# EAGLE design grbl2prll (EAGLE 8.1.0)
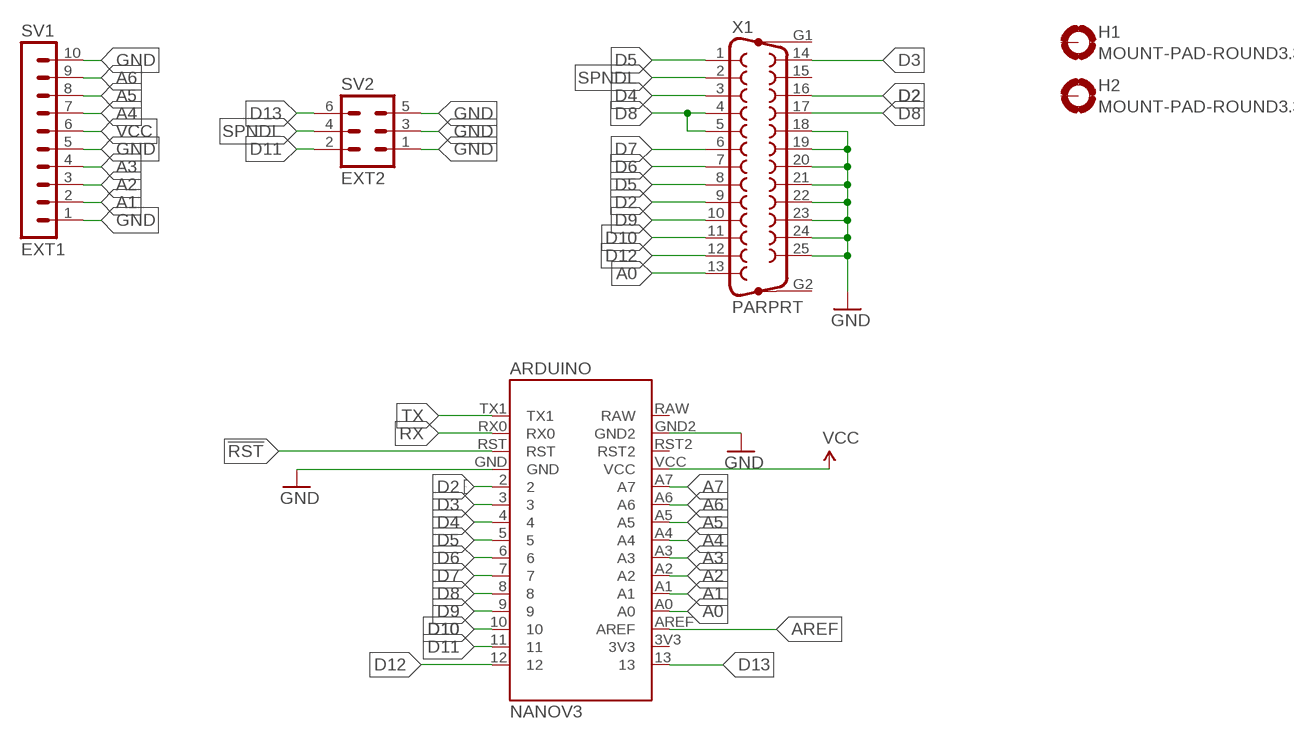
[diagram p0: schematic, sheet 1]

## Parts
ARDUINO  NANOV3  [NANOV3]
H1  MOUNT-PAD-ROUND3.3  [3,3-PAD]
H2  MOUNT-PAD-ROUND3.3  [3,3-PAD]
SV1  EXT1  MA10-1  [MA10-1]
SV2  EXT2  MA03-2  [MA03-2]
X1  PARPRT  F25HP  [F25HP]

## Nets
!RST: ARDUINO.RST
A0: ARDUINO.A0 X1.13
A1: ARDUINO.A1 SV1.2
A2: ARDUINO.A2 SV1.3
A3: ARDUINO.A3 SV1.4
A4: ARDUINO.A4 SV1.7
A5: ARDUINO.A5 SV1.8
A6: ARDUINO.A6 SV1.9
A7: ARDUINO.A7
AREF: ARDUINO.AREF
D2: ARDUINO.2 X1.9 X1.16
D3: ARDUINO.3 X1.14
D4: ARDUINO.4 X1.3
D5: ARDUINO.5 X1.1 X1.8
D6: ARDUINO.6 X1.7
D7: ARDUINO.7 X1.6
D8: ARDUINO.8 X1.4 X1.5 X1.17
D9: ARDUINO.9 X1.10
D10: ARDUINO.10 X1.11
D11: ARDUINO.11 SV2.2
D12: ARDUINO.12 X1.12
D13: ARDUINO.13 SV2.6
GND [GND]: ARDUINO.GND ARDUINO.GND2 SV1.1 SV1.5 SV1.10 SV2.1 SV2.3 SV2.5 X1.18 X1.19 X1.20 X1.21 X1.22 X1.23 X1.24 X1.25
RX: ARDUINO.RX0
SPNDL: SV2.4 X1.2
TX: ARDUINO.TX1
VCC [VCC]: ARDUINO.VCC SV1.6
Unconnected: ARDUINO.3V3 ARDUINO.RAW ARDUINO.RST2 H1.B3,3(MOUNT) H2.B3,3(MOUNT) X1.15 X1.G1 X1.G2

## Library data of the parts
ARDUINO = Arduino Nano by Jazz:NANOV3
H1 H2 = holes:MOUNT-PAD-ROUND: MOUNTING PAD, round
SV1 = con-lstb:MA10-1: PIN HEADER; OC_FARNELL: unknown; OC_NEWARK: unknown
SV2 = con-lstb:MA03-2: PIN HEADER; OC_FARNELL: unknown; OC_NEWARK: unknown
X1 = con-subd:F25HP: SUB-D; OC_FARNELL: unknown; OC_NEWARK: unknown

## Net classes
0 default: width 0.762 mm, clearance 0.406 mm
1 GND: width 1.27 mm, clearance 0.406 mm
2 VCC: width 1.27 mm, clearance 0.406 mm

## Board
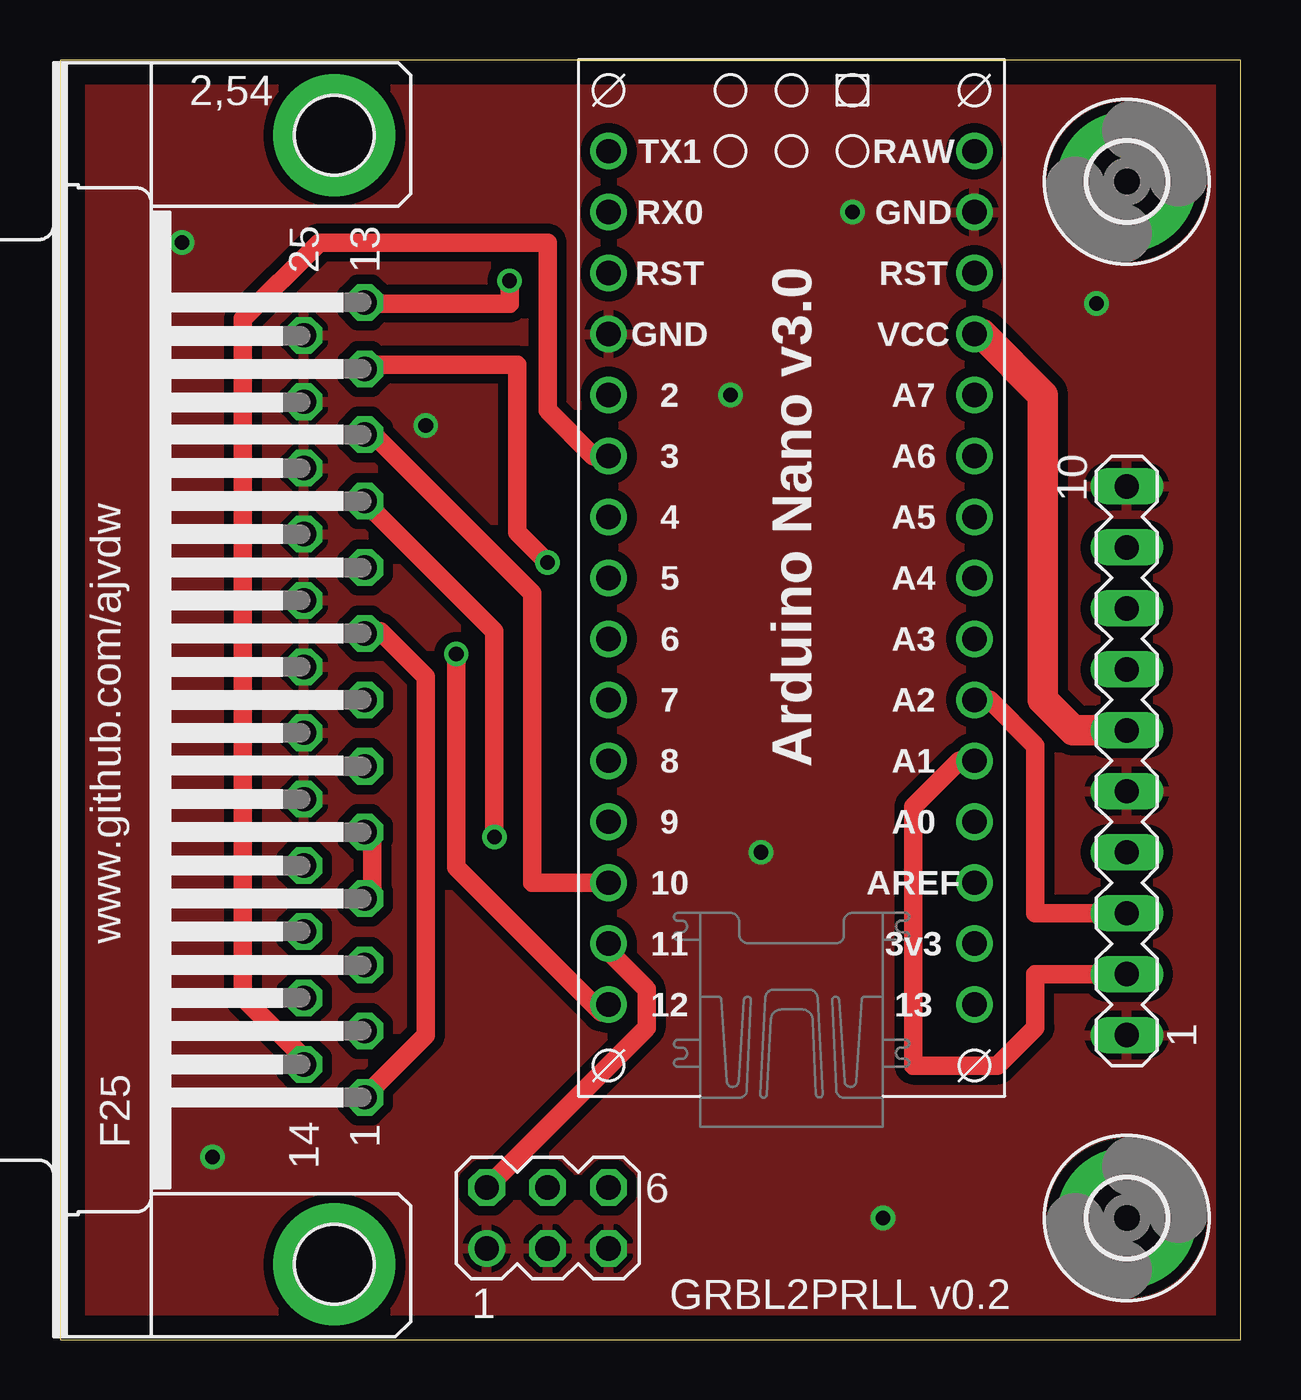
[diagram p1: board, top side]
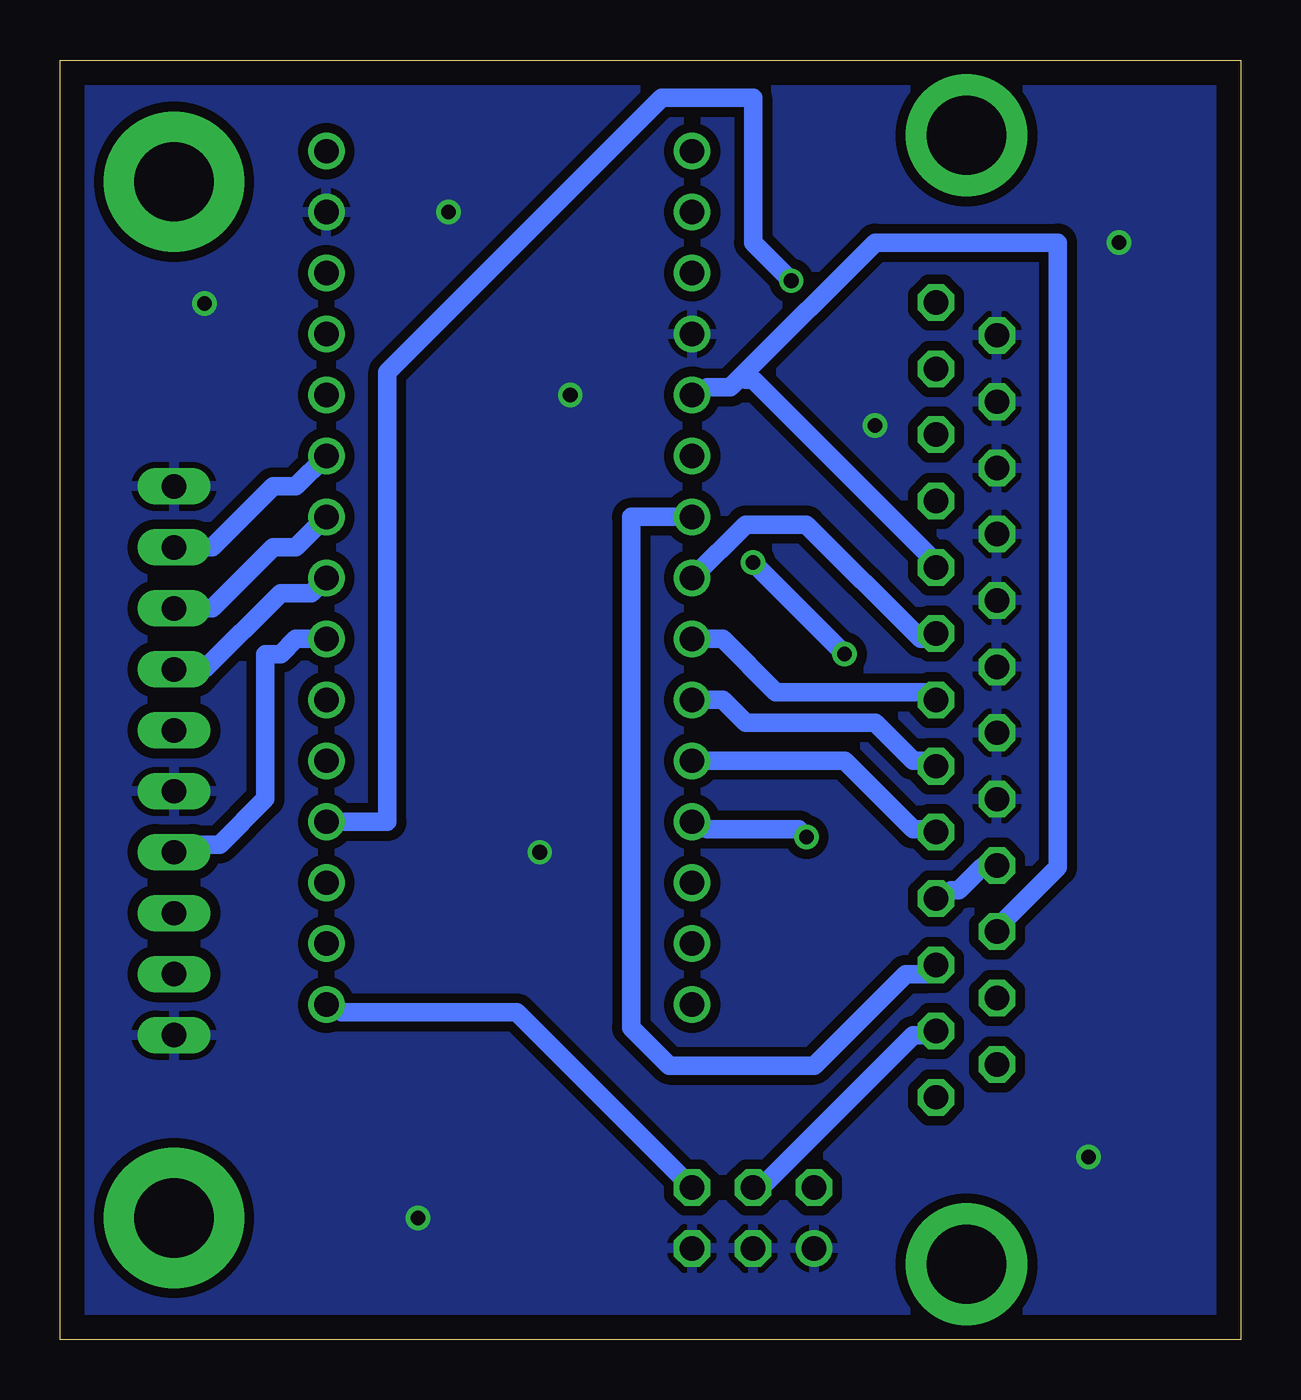
[diagram p2: board, bottom side, seen from below]

Size 49.2 x 53.33 mm. Coordinates in mm from the lower left corner, seen from the top.
Outline: 0,0 49.2,0 49.2,53.33 0,53.33 0,0
Copper layers (1*16): Top 0.035mm / dielectric 1.5mm / Bottom 0.035mm
Design rules "default": minimum track width 10mil, minimum drill 24mil, track to track 8mil, track to pad 8mil, pad to pad 8mil, via to via 8mil, smd to smd 8mil, copper to edge 40mil, drill to drill 8mil, minimum pad ring 10mil, minimum via ring 8mil, stop-mask expansion 4mil, vias tented up to drill 0mil, thermal gap 10mil

### Footprints (pad centres in the part's own frame; a part is rotated, then mirrored left to right if it is on the bottom)
NANOV3 = drill 1.016: 2 -7.62,5.08; 3 -7.62,2.54; 3V3 7.62,-17.78; 4 -7.62,0; 5 -7.62,-2.54; 6 -7.62,-5.08; 7 -7.62,-7.62; 8 -7.62,-10.16; 9 -7.62,-12.7; 10 -7.62,-15.24; 11 -7.62,-17.78; 12 -7.62,-20.32; 13 7.62,-20.32; A0 7.62,-12.7; A1 7.62,-10.16; A2 7.62,-7.62; A3 7.62,-5.08; A4 7.62,-2.54; A5 7.62,0; A6 7.62,2.54; A7 7.62,5.08; AREF 7.62,-15.24; GND -7.62,7.62; GND2 7.62,12.7; RAW 7.62,15.24; RST -7.62,10.16; RST2 7.62,10.16; RX0 -7.62,12.7; TX1 -7.62,15.24; VCC 7.62,7.62
3,3-PAD = drill 3.3 pad 5.842: B3,3 0,0
MA10-1 = drill 1.016 long: 1 -11.43,0; 2 -8.89,0; 3 -6.35,0; 4 -3.81,0; 5 -1.27,0; 6 1.27,0; 7 3.81,0; 8 6.35,0; 9 8.89,0; 10 11.43,0
MA03-2 = drill 1.016: 1 -2.54,-1.27 | drill 1.016 octagon: 2 -2.54,1.27; 3 0,-1.27; 4 0,1.27; 5 2.54,-1.27; 6 2.54,1.27
F25HP = drill 1.016 octagon: 1 -16.561,-1.27; 2 -13.792,-1.27; 3 -11.049,-1.27; 4 -8.28,-1.27; 5 -5.512,-1.27; 6 -2.769,-1.27; 7 0,-1.27; 8 2.769,-1.27; 9 5.512,-1.27; 10 8.28,-1.27; 11 11.049,-1.27; 12 13.792,-1.27; 13 16.561,-1.27; 14 -15.189,1.27; 15 -12.421,1.27; 16 -9.652,1.27; 17 -6.909,1.27; 18 -4.14,1.27; 19 -1.372,1.27; 20 1.372,1.27; 21 4.14,1.27; 22 6.909,1.27; 23 9.652,1.27; 24 12.421,1.27; 25 15.189,1.27 | drill 3.302 pad 5.08: G1 -23.52,0; G2 23.52,0

### Placement (x,y rotation side)
ARDUINO  30.48,34.29 0 top
H1  44.45,5.08 0 top
H2  44.45,48.26 0 top
SV1  44.45,24.13 90 top
SV2  20.32,5.08 0 top
X1  11.43,26.67 90 top

### Tracks (layer width: path | path; a pad name or v marks a point on that pad's centre or on a via)
A0  (via drill 0.61)
  Top 0.762: v18.73,44.13 18.73,43.18 12.7,43.18 X1.13
  Bottom 0.762: v18.73,44.13 20.32,45.72 20.32,51.75 24.13,51.75 35.56,40.32 35.56,21.59 ARDUINO.A0
A1
  Top 0.762: SV1.2 40.64,15.24 40.64,13.02 39.05,11.43 35.56,11.43 35.56,22.23 37.47,24.13 ARDUINO.A1
A2
  Top 0.762: SV1.3 40.64,17.78 40.64,24.77 38.73,26.67 ARDUINO.A2
A3
  Bottom 0.762: SV1.4 44.13,20.64 42.55,20.64 40.64,22.54 40.64,28.57 40.01,28.57 39.37,29.21 ARDUINO.A3
A4
  Bottom 0.762: ARDUINO.A4 38.73,31.11 40.01,31.11 43.18,27.94 SV1.7
A5
  Bottom 0.762: ARDUINO.A5 39.37,33.02 40.32,33.02 42.86,30.48 SV1.8
A6
  Bottom 0.762: ARDUINO.A6 39.37,35.56 40.32,35.56 42.86,33.02 SV1.9
D2
  Bottom 0.762: 20.8,40.16 21.27,39.69 22.23,39.69 22.54,39.37 ARDUINO.2 | 20.8,40.16 15.24,45.72 7.62,45.72 7.62,19.68 10.16,17.14 X1.16 | X1.9 12.7,32.38 20.32,40.01 20.64,40.01 20.8,40.16
D3
  Top 0.762: ARDUINO.3 22.23,36.83 20.32,38.73 20.32,45.72 10.79,45.72 7.62,42.55 7.62,14.29 10.16,11.75 X1.14
D4
  Bottom 0.762: ARDUINO.4 25.4,34.29 25.4,13.02 23.81,11.43 17.78,11.43 13.97,15.24 13.02,15.24 12.7,15.56 X1.3
D5
  Top 0.762: X1.1 12.7,10.16 15.24,12.7 15.24,27.62 13.34,29.53 12.7,29.53 X1.8
  Bottom 0.762: ARDUINO.5 20.64,33.97 18.1,33.97 13.34,29.21 12.7,29.21 X1.8
D6
  Bottom 0.762: X1.7 13.02,26.99 19.37,26.99 21.59,29.21 ARDUINO.6
D7
  Bottom 0.762: ARDUINO.7 21.59,26.67 20.64,25.72 15.24,25.72 13.65,24.13 12.7,24.13 X1.6
D8
  Top 0.762: X1.4 12.7,18.41 13.02,18.73 13.02,20.95 12.7,21.27 X1.5
  Bottom 0.762: X1.17 10.16,19.68 10.79,19.68 11.75,18.73 12.06,18.73 12.38,18.41 12.7,18.41 X1.4 | ARDUINO.8 16.51,24.13 13.65,21.27 12.7,21.27 X1.5
D9  (via drill 0.61)
  Top 0.762: v18.1,20.95 18.1,29.53 12.7,34.92 X1.10
  Bottom 0.762: v18.1,20.95 18.41,21.27 22.23,21.27 22.54,21.59 ARDUINO.9
D10
  Top 0.762: ARDUINO.10 19.68,19.05 19.68,31.11 13.02,37.78 12.7,37.78 X1.11
D11
  Top 0.762: SV2.2 24.45,13.02 24.45,14.61 22.86,16.19 ARDUINO.11
D12  (via drill 0.61)
  Top 0.762: v20.32,32.38 19.05,33.66 19.05,40.64 12.7,40.64 X1.12 | v16.51,28.57 16.51,19.68 22.54,13.65 22.86,13.65 ARDUINO.12
  Bottom 0.762: v16.51,28.57 v20.32,32.38
D13
  Bottom 0.762: SV2.6 30.16,13.65 37.47,13.65 37.78,13.97 ARDUINO.13
GND  (via drill 0.61)
  other vias: 5.08,45.72 33.02,46.99 27.94,39.37 43.18,43.18 29.21,20.32 34.29,5.08 6.35,7.62 15.24,38.1
  pour Bottom: 0,53.34 49.53,53.34 49.53,0 0,0
  pour Top: 0,53.34 49.53,53.34 49.53,0 0,0
SPNDL
  Bottom 0.762: SV2.4 20,6.35 13.65,12.7 12.7,12.7 X1.2
VCC
  Top 1.27: SV1.6 42.23,25.4 40.96,26.67 40.96,39.37 38.42,41.91 ARDUINO.VCC

### Text on the board
tNames: www.github.com/ajvdw | GRBL2PRLL v0.2